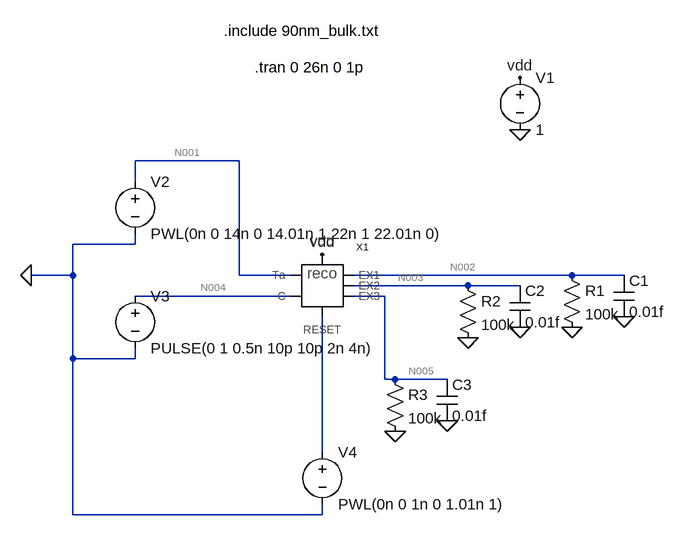
[diagram p0: schematic 4_exp2.asc]
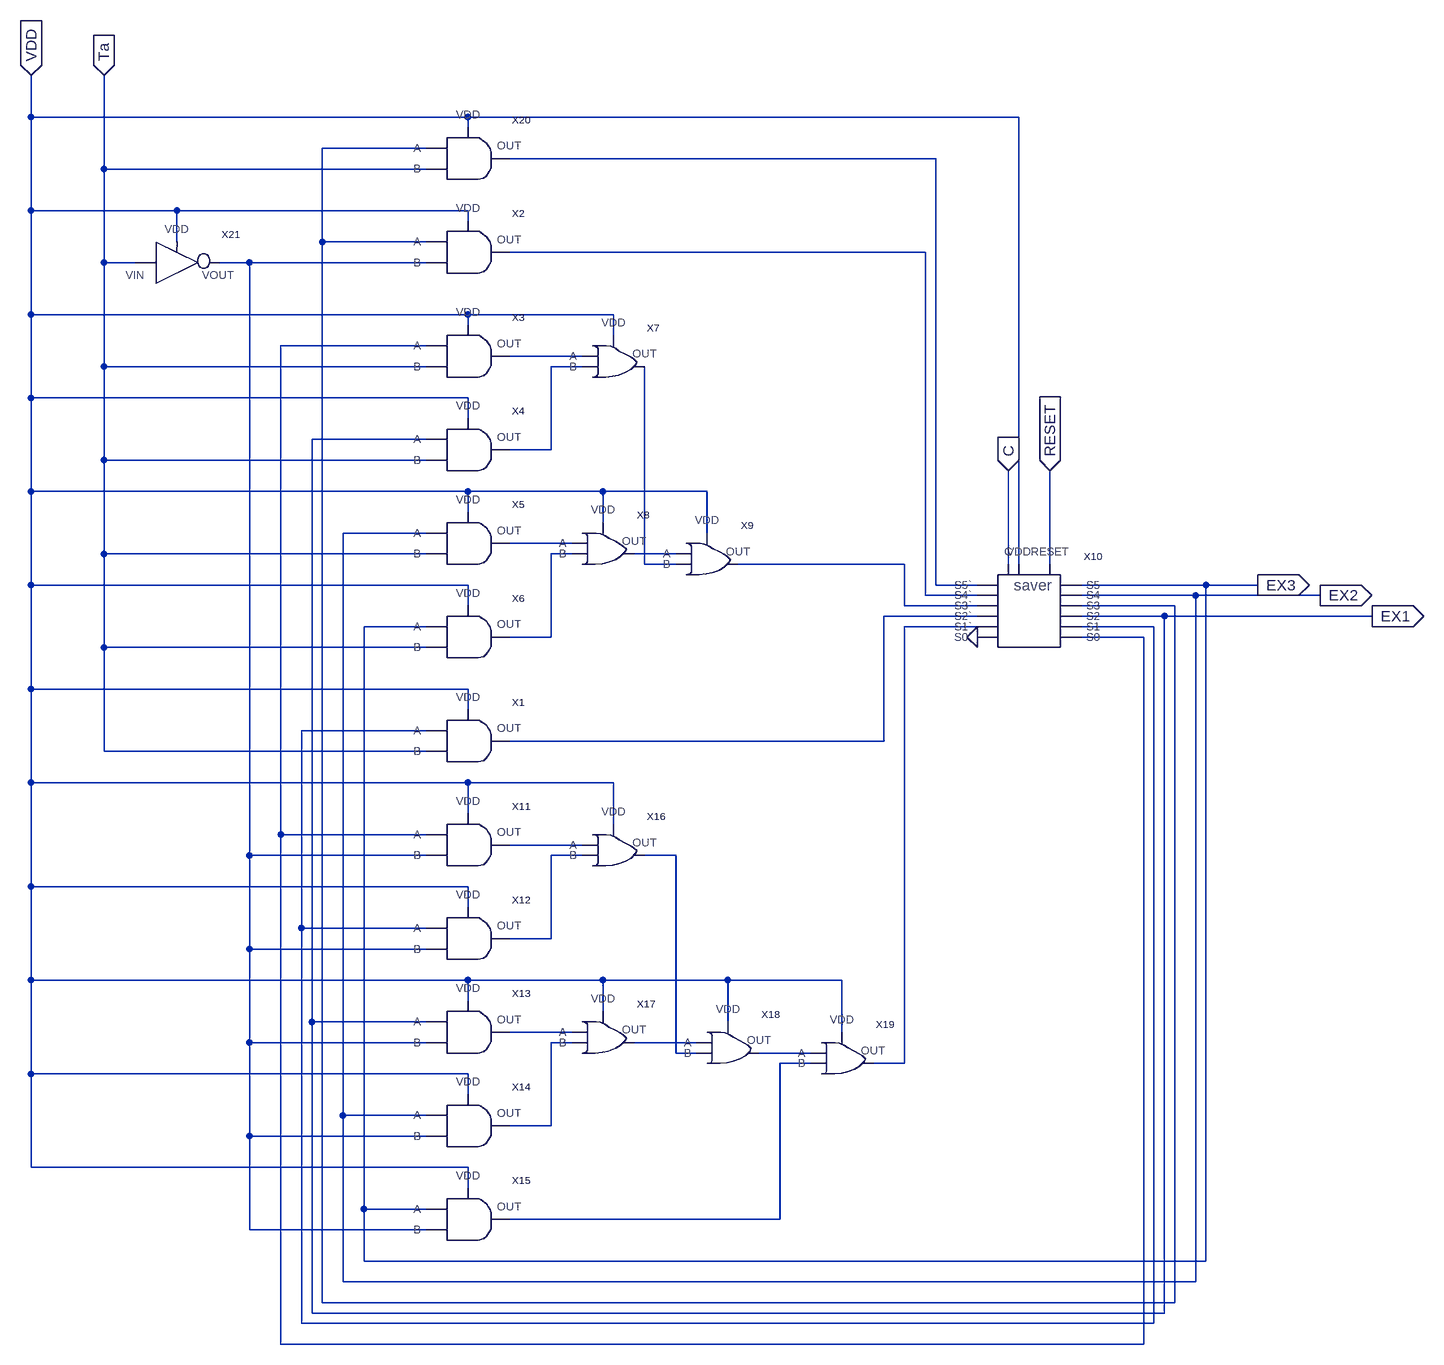
[diagram p1: sub-circuit 4_seq_recog.asc]
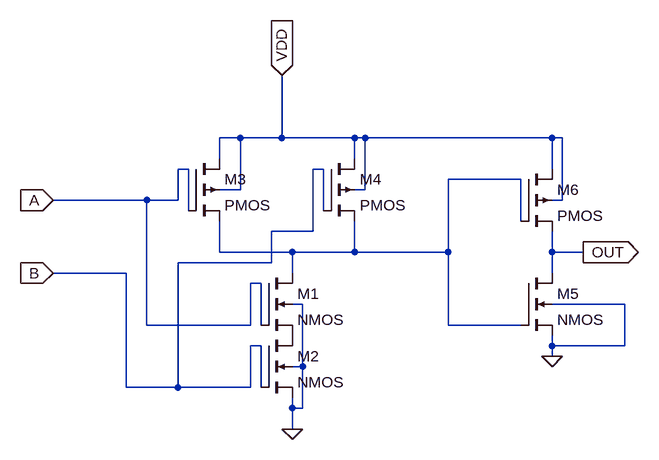
[diagram p2: sub-circuit and.asc]
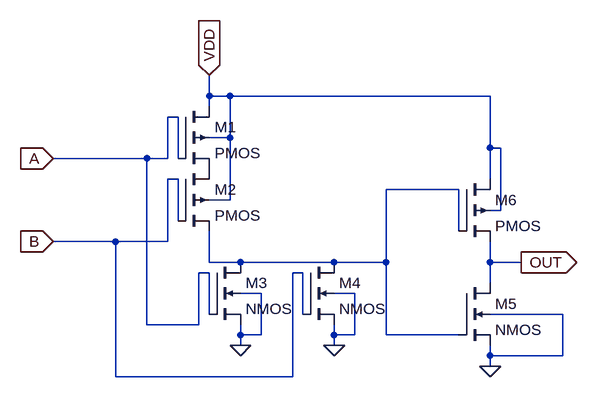
[diagram p3: sub-circuit or.asc]
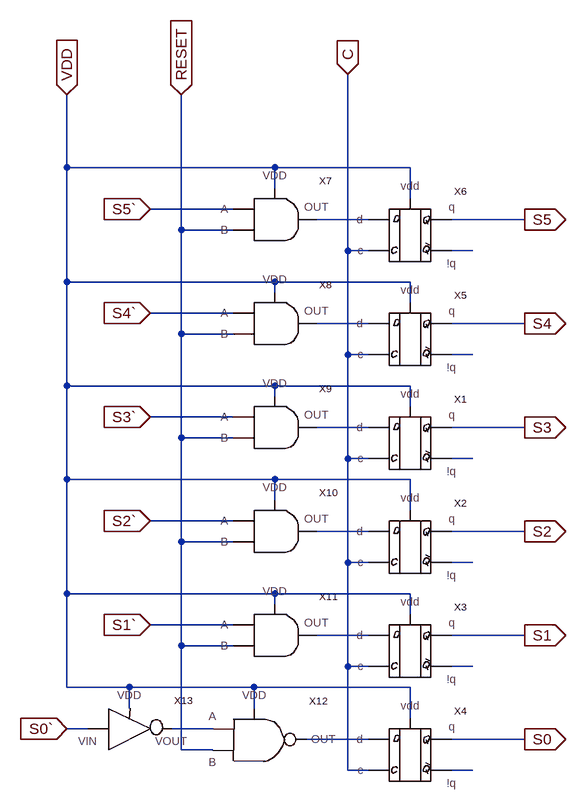
[diagram p4: sub-circuit 4_state_saver.asc]
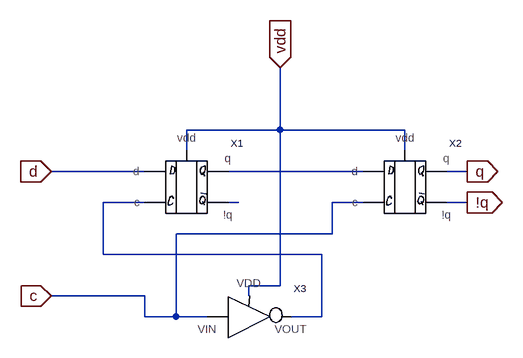
[diagram p5: sub-circuit d-front.asc]
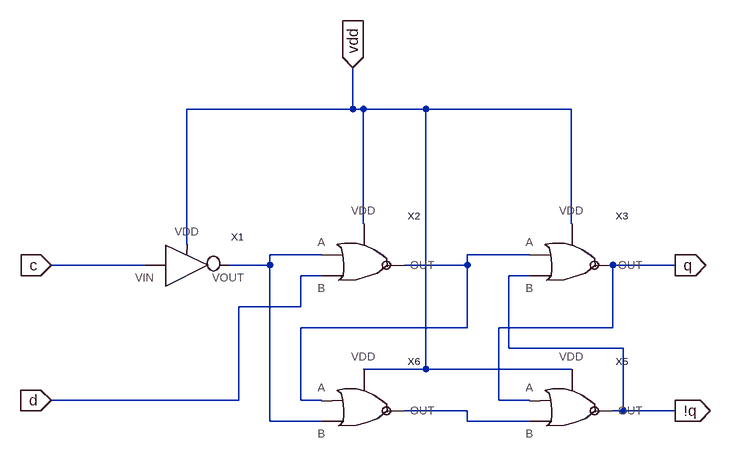
[diagram p6: sub-circuit d-level.asc]
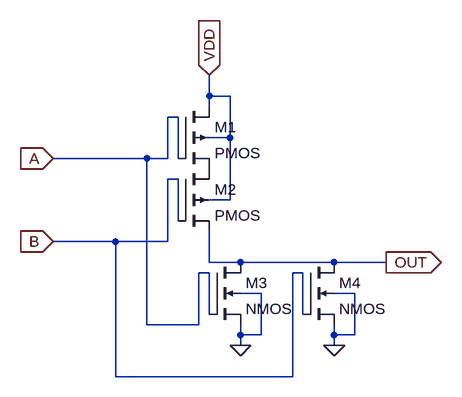
[diagram p7: sub-circuit nor.asc]
4_exp2.asc, the LTspice schematic file:
Version 4
SHEET 1 880 680
WIRE 64 -32 -96 -32
WIRE -96 0 -96 -32
WIRE -96 96 -96 80
WIRE -96 96 -192 96
WIRE -192 144 -192 96
WIRE -192 144 -256 144
WIRE 64 144 64 -32
WIRE 144 144 64 144
WIRE 576 144 240 144
WIRE 656 144 576 144
WIRE 416 160 240 160
WIRE 496 160 416 160
WIRE 144 176 -96 176
WIRE 288 176 240 176
WIRE -192 272 -192 144
WIRE -96 272 -96 256
WIRE -96 272 -192 272
WIRE 288 304 288 176
WIRE 304 304 288 304
WIRE 384 304 304 304
WIRE 192 416 192 208
WIRE -192 512 -192 272
WIRE 192 512 192 496
WIRE 192 512 -192 512
FLAG 576 224 0
FLAG 656 208 0
FLAG 416 240 0
FLAG 496 224 0
FLAG 304 384 0
FLAG 384 368 0
FLAG 192 112 vdd
FLAG 496 -160 vdd
FLAG 496 -80 0
FLAG -256 144 0
SYMBOL 4_seq_recog 192 160 R0
SYMATTR InstName X1
SYMBOL res 560 128 R0
SYMATTR InstName R1
SYMATTR Value 100k
SYMBOL cap 640 144 R0
SYMATTR InstName C1
SYMATTR Value 0.01f
SYMBOL res 400 144 R0
SYMATTR InstName R2
SYMATTR Value 100k
SYMBOL cap 480 160 R0
SYMATTR InstName C2
SYMATTR Value 0.01f
SYMBOL res 288 288 R0
SYMATTR InstName R3
SYMATTR Value 100k
SYMBOL cap 368 304 R0
SYMATTR InstName C3
SYMATTR Value 0.01f
SYMBOL voltage 496 -176 R0
WINDOW 123 0 0 Left 2
WINDOW 39 0 0 Left 2
SYMATTR InstName V1
SYMATTR Value 1
SYMBOL voltage -96 -16 R0
WINDOW 123 0 0 Left 2
WINDOW 39 0 0 Left 2
SYMATTR InstName V2
SYMATTR Value PWL(0n 0 14n 0 14.01n 1 22n 1 22.01n 0)
SYMBOL voltage -96 160 R0
WINDOW 123 0 0 Left 2
WINDOW 39 0 0 Left 2
SYMATTR InstName V3
SYMATTR Value PULSE(0 1 0.5n 10p 10p 2n 4n)
SYMBOL voltage 192 400 R0
WINDOW 123 0 0 Left 2
WINDOW 39 0 0 Left 2
SYMATTR InstName V4
SYMATTR Value PWL(0n 0 1n 0 1.01n 1)
TEXT 40 -232 Left 2 !.include 90nm_bulk.txt
TEXT 88 -176 Left 2 !.tran 0 26n 0 1p

4_seq_recog.asc, the sub-circuit schematic file:
Version 4
SHEET 1 1868 1252
WIRE -896 -640 -896 -704
WIRE -224 -640 -896 -640
WIRE 624 -640 -224 -640
WIRE -224 -624 -224 -640
WIRE -288 -592 -448 -592
WIRE 496 -576 -160 -576
WIRE -784 -560 -784 -704
WIRE -288 -560 -784 -560
WIRE -896 -496 -896 -640
WIRE -672 -496 -896 -496
WIRE -224 -496 -672 -496
WIRE -224 -480 -224 -496
WIRE -672 -448 -672 -496
WIRE -448 -448 -448 -592
WIRE -288 -448 -448 -448
WIRE 480 -432 -160 -432
WIRE -784 -416 -784 -560
WIRE -736 -416 -784 -416
WIRE -560 -416 -608 -416
WIRE -288 -416 -560 -416
WIRE -896 -336 -896 -496
WIRE -224 -336 -896 -336
WIRE 0 -336 -224 -336
WIRE -224 -320 -224 -336
WIRE 0 -304 0 -336
WIRE -288 -288 -512 -288
WIRE -48 -272 -160 -272
WIRE -784 -256 -784 -416
WIRE -288 -256 -784 -256
WIRE -48 -256 -96 -256
WIRE -896 -208 -896 -336
WIRE -224 -208 -896 -208
WIRE -224 -176 -224 -208
WIRE -288 -144 -464 -144
WIRE -96 -128 -96 -256
WIRE -96 -128 -160 -128
WIRE -784 -112 -784 -256
WIRE -288 -112 -784 -112
WIRE -896 -64 -896 -208
WIRE -224 -64 -896 -64
WIRE -16 -64 -224 -64
WIRE 144 -64 -16 -64
WIRE -224 -32 -224 -64
WIRE -16 -16 -16 -64
WIRE -288 0 -416 0
WIRE 144 0 144 -64
WIRE -64 16 -160 16
WIRE -784 32 -784 -112
WIRE -288 32 -784 32
WIRE -64 32 -96 32
WIRE 96 32 32 32
WIRE 48 48 48 -256
WIRE 96 48 48 48
WIRE 448 48 192 48
WIRE 608 48 608 -96
WIRE 624 48 624 -640
WIRE 672 48 672 -96
WIRE -896 80 -896 -64
WIRE -224 80 -896 80
WIRE 496 80 496 -576
WIRE 560 80 496 80
WIRE 912 80 720 80
WIRE 992 80 912 80
WIRE 480 96 480 -432
WIRE 560 96 480 96
WIRE 896 96 720 96
WIRE 1088 96 896 96
WIRE -224 112 -224 80
WIRE 448 112 448 48
WIRE 560 112 448 112
WIRE 864 112 720 112
WIRE 560 128 416 128
WIRE 848 128 720 128
WIRE 1168 128 848 128
WIRE -288 144 -384 144
WIRE 560 144 448 144
WIRE 832 144 720 144
WIRE -96 160 -96 32
WIRE -96 160 -160 160
WIRE 816 160 720 160
WIRE -784 176 -784 32
WIRE -288 176 -784 176
WIRE -896 240 -896 80
WIRE -224 240 -896 240
WIRE -224 272 -224 240
WIRE -288 304 -480 304
WIRE 416 320 416 128
WIRE 416 320 -160 320
WIRE -784 336 -784 176
WIRE -288 336 -784 336
WIRE -896 384 -896 240
WIRE -224 384 -896 384
WIRE 0 384 -224 384
WIRE -224 432 -224 384
WIRE 0 448 0 384
WIRE -512 464 -512 -288
WIRE -288 464 -512 464
WIRE -48 480 -160 480
WIRE -560 496 -560 -416
WIRE -288 496 -560 496
WIRE -48 496 -96 496
WIRE 96 496 48 496
WIRE -896 544 -896 384
WIRE -224 544 -896 544
WIRE -224 576 -224 544
WIRE -480 608 -480 304
WIRE -288 608 -480 608
WIRE -96 624 -96 496
WIRE -96 624 -160 624
WIRE -560 640 -560 496
WIRE -288 640 -560 640
WIRE -896 688 -896 544
WIRE -224 688 -896 688
WIRE -16 688 -224 688
WIRE 176 688 -16 688
WIRE 352 688 176 688
WIRE -224 720 -224 688
WIRE -16 736 -16 688
WIRE -464 752 -464 -144
WIRE -288 752 -464 752
WIRE 176 752 176 688
WIRE -64 768 -160 768
WIRE 352 768 352 688
WIRE -560 784 -560 640
WIRE -288 784 -560 784
WIRE -64 784 -96 784
WIRE 128 784 32 784
WIRE 96 800 96 496
WIRE 128 800 96 800
WIRE 304 800 224 800
WIRE 304 816 256 816
WIRE 448 816 448 144
WIRE 448 816 400 816
WIRE -896 832 -896 688
WIRE -224 832 -896 832
WIRE -224 864 -224 832
WIRE -416 896 -416 0
WIRE -288 896 -416 896
WIRE -96 912 -96 784
WIRE -96 912 -160 912
WIRE -560 928 -560 784
WIRE -288 928 -560 928
WIRE -896 976 -896 832
WIRE -224 976 -896 976
WIRE -224 1008 -224 976
WIRE -384 1040 -384 144
WIRE -288 1040 -384 1040
WIRE 256 1056 256 816
WIRE 256 1056 -160 1056
WIRE -560 1072 -560 928
WIRE -288 1072 -560 1072
WIRE -384 1120 -384 1040
WIRE 912 1120 912 80
WIRE 912 1120 -384 1120
WIRE -416 1152 -416 896
WIRE 896 1152 896 96
WIRE 896 1152 -416 1152
WIRE -448 1184 -448 -448
WIRE 864 1184 864 112
WIRE 864 1184 -448 1184
WIRE -464 1200 -464 752
WIRE 848 1200 848 128
WIRE 848 1200 -464 1200
WIRE -480 1216 -480 608
WIRE 832 1216 832 144
WIRE 832 1216 -480 1216
WIRE -512 1248 -512 464
WIRE 816 1248 816 160
WIRE 816 1248 -512 1248
FLAG 560 160 0
FLAG -784 -704 Ta
IOPIN -784 -704 In
FLAG 608 -96 C
IOPIN 608 -96 In
FLAG 672 -96 RESET
IOPIN 672 -96 In
FLAG 1168 128 EX1
IOPIN 1168 128 Out
FLAG 1088 96 EX2
IOPIN 1088 96 Out
FLAG 992 80 EX3
IOPIN 992 80 Out
FLAG -896 -704 VDD
IOPIN -896 -704 In
SYMBOL and -240 -432 R0
SYMATTR InstName X2
SYMBOL and -240 -272 R0
SYMATTR InstName X3
SYMBOL and -240 -128 R0
SYMATTR InstName X4
SYMBOL and -240 16 R0
SYMATTR InstName X5
SYMBOL and -240 160 R0
SYMATTR InstName X6
SYMBOL or 16 -256 R0
SYMATTR InstName X7
SYMBOL or 0 32 R0
SYMATTR InstName X8
SYMBOL or 160 48 R0
SYMATTR InstName X9
SYMBOL 4_state_saver 640 128 R0
SYMATTR InstName X10
SYMBOL and -240 320 R0
SYMATTR InstName X1
SYMBOL and -240 480 R0
SYMATTR InstName X11
SYMBOL and -240 624 R0
SYMATTR InstName X12
SYMBOL and -240 768 R0
SYMATTR InstName X13
SYMBOL and -240 912 R0
SYMATTR InstName X14
SYMBOL and -240 1056 R0
SYMATTR InstName X15
SYMBOL or 16 496 R0
SYMATTR InstName X16
SYMBOL or 0 784 R0
SYMATTR InstName X17
SYMBOL or 192 800 R0
SYMATTR InstName X18
SYMBOL or 368 816 R0
SYMATTR InstName X19
SYMBOL and -240 -576 R0
SYMATTR InstName X20
SYMBOL inverter -672 -416 R0
SYMATTR InstName X21

and.asc, the sub-circuit schematic file:
Version 4
SHEET 1 1116 788
WIRE 112 -32 80 -32
WIRE 176 -32 176 -128
WIRE 176 -32 112 -32
WIRE 288 -32 176 -32
WIRE 304 -32 288 -32
WIRE 592 -32 304 -32
WIRE 608 -32 592 -32
WIRE 80 0 80 -32
WIRE 288 0 288 -32
WIRE 32 16 16 16
WIRE 240 16 224 16
WIRE 592 16 592 -32
WIRE 544 32 432 32
WIRE 112 48 112 -32
WIRE 112 48 80 48
WIRE 304 48 304 -32
WIRE 304 48 288 48
WIRE -32 64 -176 64
WIRE 16 64 16 16
WIRE 16 64 -32 64
WIRE 608 64 608 -32
WIRE 608 64 592 64
WIRE 32 80 32 16
WIRE 240 80 240 16
WIRE 544 96 544 32
WIRE 224 112 224 16
WIRE 224 112 160 112
WIRE 80 144 80 96
WIRE 192 144 80 144
WIRE 288 144 288 96
WIRE 288 144 192 144
WIRE 432 144 432 32
WIRE 432 144 288 144
WIRE 592 144 592 112
WIRE 640 144 592 144
WIRE 160 160 160 112
WIRE 160 160 16 160
WIRE -64 176 -176 176
WIRE 192 176 192 144
WIRE 592 176 592 144
WIRE 144 192 128 192
WIRE 208 224 192 224
WIRE 704 224 592 224
WIRE -32 256 -32 64
WIRE 128 256 128 192
WIRE 128 256 -32 256
WIRE 144 256 144 192
WIRE 432 256 432 144
WIRE 544 256 432 256
WIRE 144 288 128 288
WIRE 592 288 592 272
WIRE 704 288 704 224
WIRE 704 288 592 288
WIRE 592 304 592 288
WIRE 208 320 208 224
WIRE 208 320 192 320
WIRE -64 352 -64 176
WIRE 16 352 16 160
WIRE 16 352 -64 352
WIRE 128 352 128 288
WIRE 128 352 16 352
WIRE 144 352 144 288
WIRE 192 384 192 368
WIRE 208 384 208 320
WIRE 208 384 192 384
WIRE 192 416 192 384
FLAG 192 416 0
FLAG -176 64 A
IOPIN -176 64 In
FLAG -176 176 B
IOPIN -176 176 In
FLAG 176 -128 VDD
IOPIN 176 -128 In
FLAG 592 304 0
FLAG 640 144 OUT
IOPIN 640 144 Out
SYMBOL nmos4 144 176 R0
SYMATTR InstName M1
SYMATTR Value2 l=90n w=200n
SYMBOL nmos4 144 272 R0
SYMATTR InstName M2
SYMATTR Value2 l=90n w=200n
SYMBOL pmos4 32 0 R0
SYMATTR InstName M3
SYMATTR Value2 l=90n w=400n
SYMBOL pmos4 240 0 R0
SYMATTR InstName M4
SYMATTR Value2 l=90n w=400n
SYMBOL nmos4 544 176 R0
SYMATTR Value2 l=90n w=200n
SYMATTR InstName M5
SYMBOL pmos4 544 16 R0
SYMATTR Value2 l=90n w=400n
SYMATTR InstName M6

or.asc, the sub-circuit schematic file:
Version 4
SHEET 1 1084 680
WIRE 32 -32 32 -64
WIRE 64 -32 32 -32
WIRE 464 -32 64 -32
WIRE 32 -16 32 -32
WIRE -16 0 -32 0
WIRE 64 32 64 -32
WIRE 64 32 32 32
WIRE 464 48 464 -32
WIRE 480 48 464 48
WIRE -64 64 -208 64
WIRE -32 64 -32 0
WIRE -32 64 -64 64
WIRE -16 64 -16 0
WIRE -16 96 -32 96
WIRE 464 96 464 48
WIRE 416 112 304 112
WIRE 64 128 64 32
WIRE 64 128 32 128
WIRE 480 144 480 48
WIRE 480 144 464 144
WIRE -16 160 -16 96
WIRE 416 176 416 112
WIRE -112 192 -208 192
WIRE -32 192 -32 96
WIRE -32 192 -112 192
WIRE 32 224 32 176
WIRE 80 224 32 224
WIRE 224 224 80 224
WIRE 304 224 304 112
WIRE 304 224 224 224
WIRE 464 224 464 192
WIRE 512 224 464 224
WIRE 32 240 16 240
WIRE 176 240 160 240
WIRE 464 256 464 224
WIRE 112 272 80 272
WIRE 256 272 224 272
WIRE 32 304 32 240
WIRE 176 304 176 240
WIRE 576 304 464 304
WIRE -64 320 -64 64
WIRE 16 320 16 240
WIRE 16 320 -64 320
WIRE 80 336 80 320
WIRE 112 336 112 272
WIRE 112 336 80 336
WIRE 224 336 224 320
WIRE 256 336 256 272
WIRE 256 336 224 336
WIRE 304 336 304 224
WIRE 416 336 304 336
WIRE 80 352 80 336
WIRE 224 352 224 336
WIRE 464 368 464 352
WIRE 576 368 576 304
WIRE 576 368 464 368
WIRE 464 384 464 368
WIRE -112 400 -112 192
WIRE 160 400 160 240
WIRE 160 400 -112 400
FLAG 32 -64 VDD
IOPIN 32 -64 In
FLAG 80 352 0
FLAG 224 352 0
FLAG -208 64 A
IOPIN -208 64 In
FLAG -208 192 B
IOPIN -208 192 In
FLAG 464 384 0
FLAG 512 224 OUT
IOPIN 512 224 Out
SYMBOL pmos4 -16 -16 R0
SYMATTR InstName M1
SYMATTR Value2 l=90n w=400n
SYMBOL pmos4 -16 80 R0
SYMATTR InstName M2
SYMATTR Value2 l=90n w=400n
SYMBOL nmos4 32 224 R0
SYMATTR InstName M3
SYMATTR Value2 l=90n w=200n
SYMBOL nmos4 176 224 R0
SYMATTR InstName M4
SYMATTR Value2 l=90n w=200n
SYMBOL nmos4 416 256 R0
SYMATTR Value2 l=90n w=200n
SYMATTR InstName M5
SYMBOL pmos4 416 96 R0
SYMATTR Value2 l=90n w=400n
SYMATTR InstName M6

4_state_saver.asc, the sub-circuit schematic file:
Version 4
SHEET 1 880 680
WIRE -336 -352 -336 -464
WIRE -16 -352 -336 -352
WIRE 192 -352 -16 -352
WIRE -16 -320 -16 -352
WIRE 192 -304 192 -352
WIRE -80 -288 -208 -288
WIRE 128 -272 48 -272
WIRE 368 -272 256 -272
WIRE -160 -256 -160 -464
WIRE -80 -256 -160 -256
WIRE 96 -224 96 -496
WIRE 128 -224 96 -224
WIRE 288 -224 256 -224
WIRE -336 -176 -336 -352
WIRE -16 -176 -336 -176
WIRE 192 -176 -16 -176
WIRE -16 -160 -16 -176
WIRE 192 -144 192 -176
WIRE -80 -128 -208 -128
WIRE 128 -112 48 -112
WIRE 368 -112 256 -112
WIRE -160 -96 -160 -256
WIRE -80 -96 -160 -96
WIRE 96 -64 96 -224
WIRE 128 -64 96 -64
WIRE 288 -64 256 -64
WIRE -336 -16 -336 -176
WIRE -16 -16 -336 -16
WIRE 192 -16 -16 -16
WIRE -16 0 -16 -16
WIRE 192 16 192 -16
WIRE -80 32 -208 32
WIRE 128 48 48 48
WIRE 368 48 256 48
WIRE -160 64 -160 -96
WIRE -80 64 -160 64
WIRE 96 96 96 -64
WIRE 128 96 96 96
WIRE 288 96 256 96
WIRE -336 128 -336 -16
WIRE -16 128 -336 128
WIRE 192 128 -16 128
WIRE -16 160 -16 128
WIRE 192 176 192 128
WIRE -80 192 -208 192
WIRE 128 208 48 208
WIRE 368 208 256 208
WIRE -160 224 -160 64
WIRE -80 224 -160 224
WIRE 96 256 96 96
WIRE 128 256 96 256
WIRE 288 256 256 256
WIRE -336 304 -336 128
WIRE -16 304 -336 304
WIRE 192 304 -16 304
WIRE -16 320 -16 304
WIRE 192 336 192 304
WIRE -80 352 -208 352
WIRE 128 368 48 368
WIRE 368 368 256 368
WIRE -160 384 -160 224
WIRE -80 384 -160 384
WIRE 96 416 96 256
WIRE 128 416 96 416
WIRE 288 416 256 416
WIRE -336 448 -336 304
WIRE -240 448 -336 448
WIRE -48 448 -240 448
WIRE 192 448 -48 448
WIRE -240 480 -240 448
WIRE -48 480 -48 448
WIRE 192 496 192 448
WIRE -304 512 -336 512
WIRE -112 512 -176 512
WIRE 128 528 32 528
WIRE 368 528 256 528
WIRE -160 544 -160 384
WIRE -112 544 -160 544
WIRE 96 576 96 416
WIRE 128 576 96 576
WIRE 288 576 256 576
FLAG -160 -464 RESET
IOPIN -160 -464 In
FLAG -208 -288 S5`
IOPIN -208 -288 In
FLAG -208 -128 S4`
IOPIN -208 -128 In
FLAG -208 32 S3`
IOPIN -208 32 In
FLAG -208 192 S2`
IOPIN -208 192 In
FLAG -208 352 S1`
IOPIN -208 352 In
FLAG -336 512 S0`
IOPIN -336 512 In
FLAG 96 -496 C
IOPIN 96 -496 In
FLAG -336 -464 VDD
IOPIN -336 -464 In
FLAG 368 528 S0
IOPIN 368 528 Out
FLAG 368 368 S1
IOPIN 368 368 Out
FLAG 368 208 S2
IOPIN 368 208 Out
FLAG 368 48 S3
IOPIN 368 48 Out
FLAG 368 -112 S4
IOPIN 368 -112 Out
FLAG 368 -272 S5
IOPIN 368 -272 Out
SYMBOL d-front 192 80 R0
SYMATTR InstName X1
SYMBOL d-front 192 240 R0
SYMATTR InstName X2
SYMBOL d-front 192 400 R0
SYMATTR InstName X3
SYMBOL d-front 192 560 R0
SYMATTR InstName X4
SYMBOL d-front 192 -80 R0
SYMATTR InstName X5
SYMBOL d-front 192 -240 R0
SYMATTR InstName X6
SYMBOL and -32 -272 R0
SYMATTR InstName X7
SYMBOL and -32 -112 R0
SYMATTR InstName X8
SYMBOL and -32 48 R0
SYMATTR InstName X9
SYMBOL and -32 208 R0
SYMATTR InstName X10
SYMBOL and -32 368 R0
SYMATTR InstName X11
SYMBOL nand -48 528 R0
SYMATTR InstName X12
SYMBOL inverter -240 512 R0
SYMATTR InstName X13

d-front.asc, the sub-circuit schematic file:
Version 4
SHEET 1 880 680
WIRE 240 64 240 -32
WIRE 240 64 96 64
WIRE 432 64 240 64
WIRE 96 96 96 64
WIRE 432 96 432 64
WIRE 32 128 -112 128
WIRE 368 128 160 128
WIRE 528 128 496 128
WIRE 32 176 -32 176
WIRE 176 176 160 176
WIRE 368 176 320 176
WIRE 528 176 496 176
WIRE 320 224 320 176
WIRE 320 224 80 224
WIRE -32 256 -32 176
WIRE 304 256 -32 256
WIRE 240 304 240 64
WIRE 240 304 192 304
WIRE 32 320 -112 320
WIRE 192 320 192 304
WIRE 32 352 32 320
WIRE 80 352 80 224
WIRE 80 352 32 352
WIRE 128 352 80 352
WIRE 304 352 304 256
WIRE 304 352 256 352
FLAG -112 128 d
IOPIN -112 128 In
FLAG -112 320 c
IOPIN -112 320 In
FLAG 528 128 q
IOPIN 528 128 Out
FLAG 528 176 !q
IOPIN 528 176 Out
FLAG 240 -32 vdd
IOPIN 240 -32 In
SYMBOL d-level 96 160 R0
SYMATTR InstName X1
SYMBOL d-level 432 160 R0
SYMATTR InstName X2
SYMBOL inverter 192 352 R0
SYMATTR InstName X3

d-level.asc, the sub-circuit schematic file:
Version 4
SHEET 1 928 680
WIRE 352 -112 352 -176
WIRE 352 -112 96 -112
WIRE 368 -112 352 -112
WIRE 464 -112 368 -112
WIRE 688 -112 464 -112
WIRE 368 64 368 -112
WIRE 688 64 688 -112
WIRE 96 96 96 -112
WIRE 304 112 224 112
WIRE 624 112 528 112
WIRE 32 128 -112 128
WIRE 224 128 224 112
WIRE 224 128 160 128
WIRE 528 128 528 112
WIRE 528 128 432 128
WIRE 848 128 752 128
WIRE 304 144 272 144
WIRE 624 144 592 144
WIRE 272 192 272 144
WIRE 272 192 176 192
WIRE 528 224 528 128
WIRE 528 224 272 224
WIRE 752 224 752 128
WIRE 752 224 576 224
WIRE 592 256 592 144
WIRE 768 256 592 256
WIRE 464 288 464 -112
WIRE 464 288 368 288
WIRE 688 288 464 288
WIRE 176 336 176 192
WIRE 176 336 -112 336
WIRE 272 336 272 224
WIRE 304 336 272 336
WIRE 576 336 576 224
WIRE 624 336 576 336
WIRE 528 352 432 352
WIRE 768 352 768 256
WIRE 768 352 752 352
WIRE 848 352 768 352
WIRE 224 368 224 128
WIRE 304 368 224 368
WIRE 528 368 528 352
WIRE 624 368 528 368
FLAG -112 336 d
IOPIN -112 336 In
FLAG -112 128 c
IOPIN -112 128 In
FLAG 848 128 q
IOPIN 848 128 Out
FLAG 848 352 !q
IOPIN 848 352 Out
FLAG 352 -176 vdd
IOPIN 352 -176 In
SYMBOL nor 368 128 R0
SYMATTR InstName X2
SYMBOL nor 688 128 R0
SYMATTR InstName X3
SYMBOL nor 688 352 R0
SYMATTR InstName X5
SYMBOL nor 368 352 R0
SYMATTR InstName X6
SYMBOL inverter 96 128 R0
SYMATTR InstName X1

nor.asc, the sub-circuit schematic file:
Version 4
SHEET 1 880 680
WIRE 352 0 352 -32
WIRE 384 0 352 0
WIRE 352 16 352 0
WIRE 304 32 288 32
WIRE 384 64 384 0
WIRE 384 64 352 64
WIRE 256 96 112 96
WIRE 288 96 288 32
WIRE 288 96 256 96
WIRE 304 96 304 32
WIRE 304 128 288 128
WIRE 384 160 384 64
WIRE 384 160 352 160
WIRE 304 192 304 128
WIRE 208 224 112 224
WIRE 288 224 288 128
WIRE 288 224 208 224
WIRE 352 256 352 208
WIRE 400 256 352 256
WIRE 544 256 400 256
WIRE 624 256 544 256
WIRE 352 272 336 272
WIRE 496 272 480 272
WIRE 432 304 400 304
WIRE 576 304 544 304
WIRE 352 336 352 272
WIRE 496 336 496 272
WIRE 256 352 256 96
WIRE 336 352 336 272
WIRE 336 352 256 352
WIRE 400 368 400 352
WIRE 432 368 432 304
WIRE 432 368 400 368
WIRE 544 368 544 352
WIRE 576 368 576 304
WIRE 576 368 544 368
WIRE 400 384 400 368
WIRE 544 384 544 368
WIRE 208 432 208 224
WIRE 480 432 480 272
WIRE 480 432 208 432
FLAG 352 -32 VDD
IOPIN 352 -32 In
FLAG 400 384 0
FLAG 544 384 0
FLAG 624 256 OUT
IOPIN 624 256 Out
FLAG 112 96 A
IOPIN 112 96 In
FLAG 112 224 B
IOPIN 112 224 In
SYMBOL pmos4 304 16 R0
SYMATTR InstName M1
SYMATTR Value2 l=90n w=400n
SYMBOL pmos4 304 112 R0
SYMATTR InstName M2
SYMATTR Value2 l=90n w=400n
SYMBOL nmos4 352 256 R0
SYMATTR InstName M3
SYMATTR Value2 l=90n w=200n
SYMBOL nmos4 496 256 R0
SYMATTR InstName M4
SYMATTR Value2 l=90n w=200n

inverter.asc, the sub-circuit schematic file:
Version 4
SHEET 1 880 680
WIRE 176 -128 176 -160
WIRE 240 -128 176 -128
WIRE 128 -112 16 -112
WIRE 240 -80 240 -128
WIRE 240 -80 176 -80
WIRE 128 -48 128 -112
WIRE 16 0 16 -112
WIRE 16 0 -64 0
WIRE 176 0 176 -32
WIRE 224 0 176 0
WIRE 176 32 176 0
WIRE 288 80 176 80
WIRE 16 112 16 0
WIRE 128 112 16 112
WIRE 176 144 176 128
WIRE 288 144 288 80
WIRE 288 144 176 144
WIRE 176 160 176 144
FLAG 176 160 0
FLAG -64 0 VIN
IOPIN -64 0 In
FLAG 224 0 VOUT
IOPIN 224 0 Out
FLAG 176 -160 VDD
IOPIN 176 -160 In
SYMBOL nmos4 128 32 R0
WINDOW 123 56 100 Left 2
SYMATTR InstName M1
SYMATTR Value2 l=90n w='{T_SIZE}*200n'
SYMBOL pmos4 128 -128 R0
WINDOW 123 56 60 Left 2
SYMATTR InstName M2
SYMATTR Value2 l=90n w='{T_SIZE}*400n'
TEXT -104 -200 Left 2 !.param T_SIZE=1

nand.asc, the sub-circuit schematic file:
Version 4
SHEET 1 880 680
WIRE 144 -80 112 -80
WIRE 208 -80 208 -176
WIRE 208 -80 144 -80
WIRE 320 -80 208 -80
WIRE 336 -80 320 -80
WIRE 112 -48 112 -80
WIRE 320 -48 320 -80
WIRE 64 -32 48 -32
WIRE 272 -32 256 -32
WIRE 144 0 144 -80
WIRE 144 0 112 0
WIRE 336 0 336 -80
WIRE 336 0 320 0
WIRE 0 16 -144 16
WIRE 48 16 48 -32
WIRE 48 16 0 16
WIRE 64 32 64 -32
WIRE 272 32 272 -32
WIRE 256 64 256 -32
WIRE 256 64 192 64
WIRE 112 96 112 48
WIRE 224 96 112 96
WIRE 320 96 320 48
WIRE 320 96 224 96
WIRE 448 96 320 96
WIRE 192 112 192 64
WIRE 192 112 48 112
WIRE -32 128 -144 128
WIRE 224 128 224 96
WIRE 176 144 160 144
WIRE 240 176 224 176
WIRE 0 208 0 16
WIRE 160 208 160 144
WIRE 160 208 0 208
WIRE 176 208 176 144
WIRE 176 240 160 240
WIRE 240 272 240 176
WIRE 240 272 224 272
WIRE -32 304 -32 128
WIRE 48 304 48 112
WIRE 48 304 -32 304
WIRE 160 304 160 240
WIRE 160 304 48 304
WIRE 176 304 176 240
WIRE 224 336 224 320
WIRE 240 336 240 272
WIRE 240 336 224 336
WIRE 224 368 224 336
FLAG 224 368 0
FLAG 448 96 OUT
IOPIN 448 96 Out
FLAG -144 16 A
IOPIN -144 16 In
FLAG -144 128 B
IOPIN -144 128 In
FLAG 208 -176 VDD
IOPIN 208 -176 In
SYMBOL nmos4 176 128 R0
SYMATTR InstName M1
SYMATTR Value2 l=90n w=200n
SYMBOL nmos4 176 224 R0
SYMATTR InstName M2
SYMATTR Value2 l=90n w=200n
SYMBOL pmos4 64 -48 R0
SYMATTR InstName M3
SYMATTR Value2 l=90n w=400n
SYMBOL pmos4 272 -48 R0
SYMATTR InstName M4
SYMATTR Value2 l=90n w=400n

The netlist it stands for:
* 4_exp2.asc
XX1 N001 N004 vdd N006 N002 N003 N005 4_seq_recog
R1 N002 0 100k
C1 N002 0 0.01f
R2 N003 0 100k
C2 N003 0 0.01f
R3 N005 0 100k
C3 N005 0 0.01f
V1 vdd 0 1
V2 N001 0 PWL(0n 0 14n 0 14.01n 1 22n 1 22.01n 0)
V3 N004 0 PULSE(0 1 0.5n 10p 10p 2n 4n)
V4 N006 0 PWL(0n 0 1n 0 1.01n 1)

* block symbol definitions
.subckt 4_seq_recog Ta C VDD RESET EX1 EX2 EX3
XX2 VDD N001 N004 N003 and
XX3 VDD N005 Ta N006 and
XX4 VDD EX1 Ta N007 and
XX5 VDD EX2 Ta N008 and
XX6 VDD EX3 Ta N009 and
XX7 N006 N007 VDD N011 or
XX8 N008 N009 VDD N010 or
XX9 N010 N011 VDD N012 or
XX10 N002 N003 N012 N013 N014 0 EX3 EX2 N001 EX1 N015 N005 RESET VDD C 4_state_saver
XX1 VDD N015 Ta N013 and
XX11 VDD N005 N004 N016 and
XX12 VDD N015 N004 N017 and
XX13 VDD EX1 N004 N019 and
XX14 VDD EX2 N004 N020 and
XX15 VDD EX3 N004 N023 and
XX16 N016 N017 VDD N018 or
XX17 N019 N020 VDD N021 or
XX18 N021 N018 VDD N022 or
XX19 N022 N023 VDD N014 or
XX20 VDD N001 Ta N002 and
XX21 Ta VDD N004 inverter
.ends 4_seq_recog

.subckt and VDD A B OUT
M1 N001 A P001 0 NMOS l=90n w=200n
M2 P001 B 0 0 NMOS l=90n w=200n
M3 VDD A N001 VDD PMOS l=90n w=400n
M4 VDD B N001 VDD PMOS l=90n w=400n
M5 OUT N001 0 0 NMOS l=90n w=200n
M6 VDD N001 OUT VDD PMOS l=90n w=400n
.ends and

.subckt or A B VDD OUT
M1 VDD A P001 VDD PMOS l=90n w=400n
M2 P001 B N001 VDD PMOS l=90n w=400n
M3 N001 A 0 0 NMOS l=90n w=200n
M4 N001 B 0 0 NMOS l=90n w=200n
M5 OUT N001 0 0 NMOS l=90n w=200n
M6 VDD N001 OUT VDD PMOS l=90n w=400n
.ends or

.subckt 4_state_saver S5` S4` S3` S2` S1` S0` S5 S4 S3 S2 S1 S0 RESET VDD C
XX1 N005 C VDD S3 N006 d-front
XX2 N007 C VDD S2 N008 d-front
XX3 N009 C VDD S1 N010 d-front
XX4 N012 C VDD S0 N013 d-front
XX5 N003 C VDD S4 N004 d-front
XX6 N001 C VDD S5 N002 d-front
XX7 VDD S5` RESET N001 and
XX8 VDD S4` RESET N003 and
XX9 VDD S3` RESET N005 and
XX10 VDD S2` RESET N007 and
XX11 VDD S1` RESET N009 and
XX12 N011 RESET N012 VDD nand
XX13 S0` VDD N011 inverter
.ends 4_state_saver

.subckt d-front d c vdd q !q
XX1 d N002 N001 N003 vdd d-level
XX2 N001 c q !q vdd d-level
XX3 c vdd N002 inverter
.ends d-front

.subckt d-level d c q !q vdd
XX2 N001 d N002 vdd nor
XX3 N002 !q q vdd nor
XX5 q N003 !q vdd nor
XX6 N002 N001 N003 vdd nor
XX1 c vdd N001 inverter
.ends d-level

.subckt nor A B OUT VDD
M1 VDD A P001 VDD PMOS l=90n w=400n
M2 P001 B OUT VDD PMOS l=90n w=400n
M3 OUT A 0 0 NMOS l=90n w=200n
M4 OUT B 0 0 NMOS l=90n w=200n
.ends nor

.subckt inverter VIN VDD VOUT
M1 VOUT VIN 0 0 NMOS l=90n w='{T_SIZE}*200n'
M2 VDD VIN VOUT VDD PMOS l=90n w='{T_SIZE}*400n'
.param T_SIZE=1
.ends inverter

.subckt nand A B OUT VDD
M1 OUT A P001 0 NMOS l=90n w=200n
M2 P001 B 0 0 NMOS l=90n w=200n
M3 VDD A OUT VDD PMOS l=90n w=400n
M4 VDD B OUT VDD PMOS l=90n w=400n
.ends nand

.model NMOS NMOS
.model PMOS PMOS
.lib standard.mos
.include 90nm_bulk.txt
.tran 0 26n 0 1p
.backanno
.end

* Results of the author's LTspice run, read from the files saved beside the schematic
* Operating Point, zero values left out:
*   V(vdd) = 1 V
*   V(n002) = 11.75 µV
*   V(n003) = 11.75 µV
*   V(n005) = 11.75 µV
*   I(R3) = 117.5 pA
*   I(R2) = 117.5 pA
*   I(R1) = 117.5 pA
*   I(V4) = 47.71 pA
*   I(V3) = 1.571 nA
*   I(V2) = 148.5 pA
*   I(V1) = -775.9 nA
*   Ix(x1:TA) = -148.5 pA
*   Ix(x1:C) = -1.571 nA
*   Ix(x1:VDD) = 775.9 nA
*   Ix(x1:RESET) = -47.71 pA
*   Ix(x1:EX1) = -117.5 pA
*   Ix(x1:EX2) = -117.5 pA
*   Ix(x1:EX3) = -117.5 pA
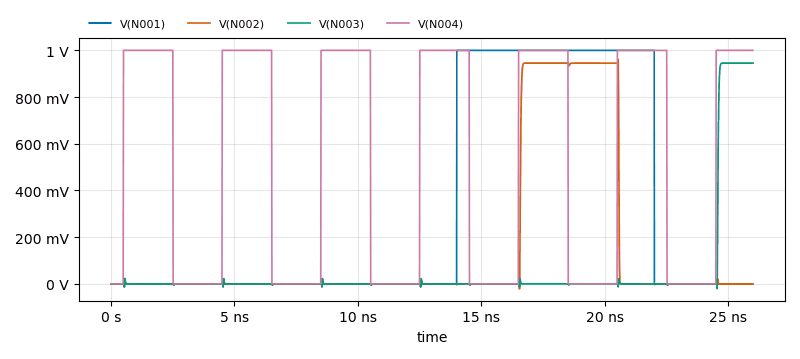
[diagram p8: Transient Analysis of 4_exp2.asc, plotted from the saved traces]
* Transient Analysis, 1 run:
*   V(N001): min 0 V, max 1 V, average 307.7 mV, rms 554.6 mV, last 0 V
*   V(N002): min -20.93 mV, max 961.2 mV, average 144.9 mV, rms 368.9 mV, last 1.412 µV
*   V(N003): min -20.93 mV, max 945.6 mV, average 51.28 mV, rms 218.8 mV, last 945.6 mV
*   V(N004): min 0 V, max 1 V, average 521.3 mV, rms 721.5 mV, last 1 V